# EAGLE design main-stm32-pdipopto-small (EAGLE 9.0.0)
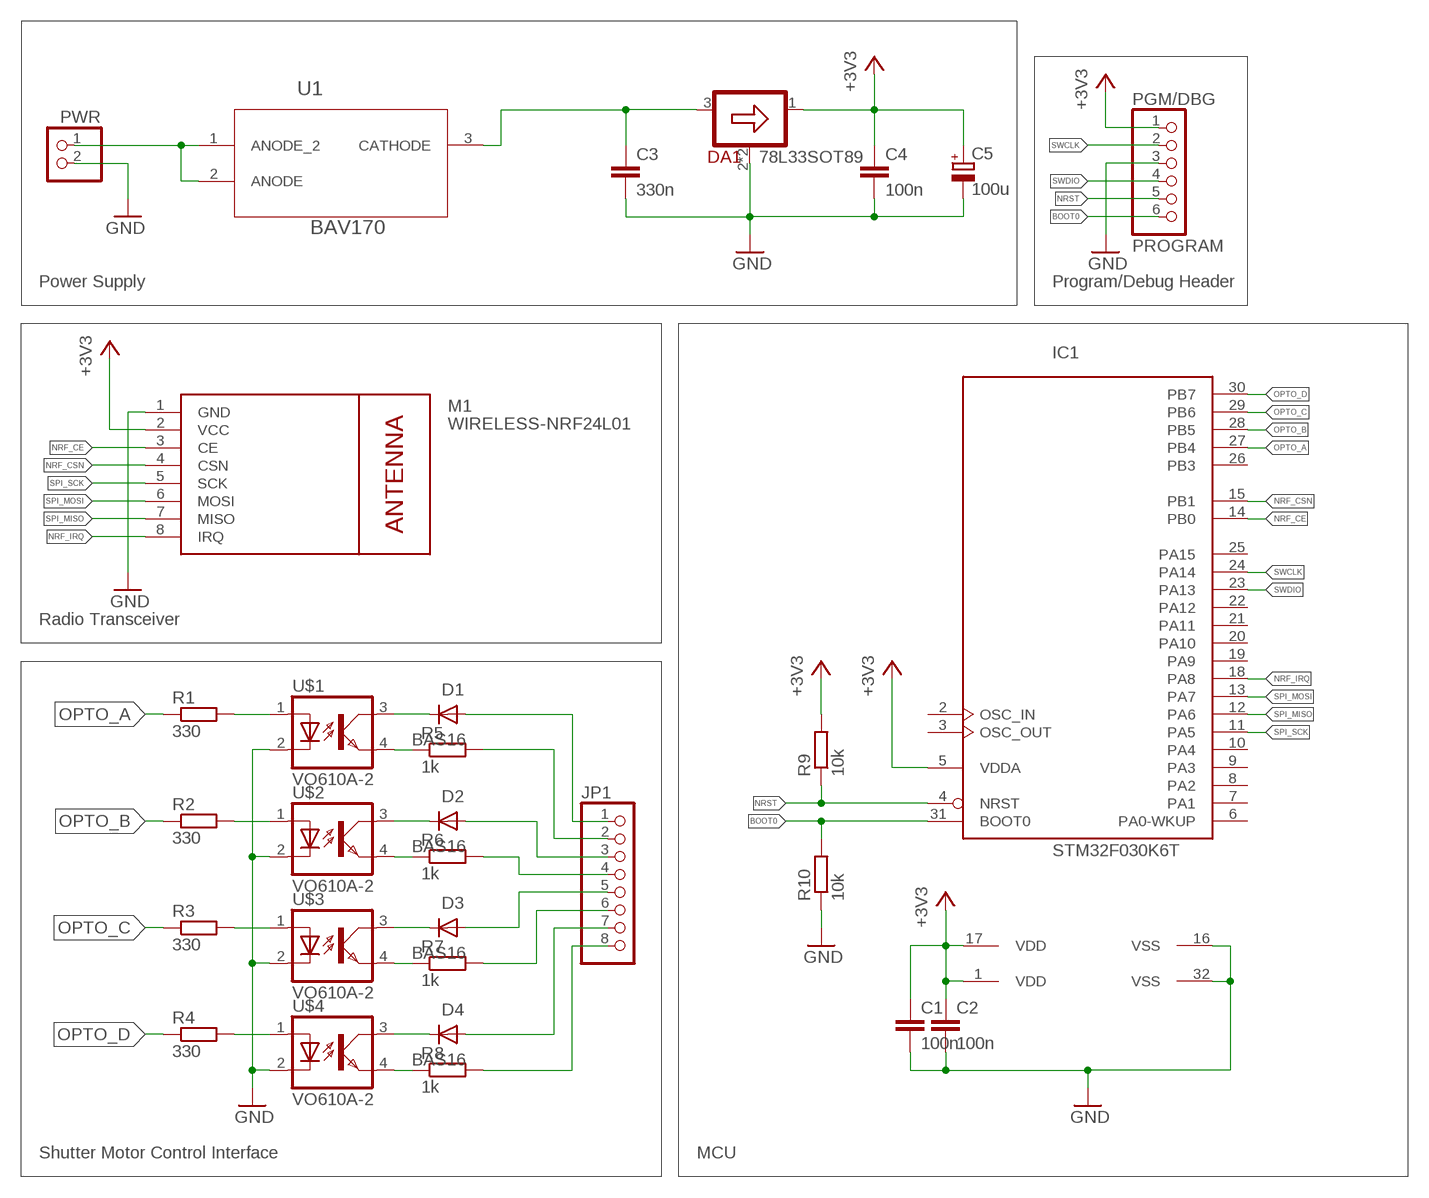
[diagram p0: schematic, sheet 1]

## Parts
C1  100n  C-EUC0805  [C0805]
C2  100n  C-EUC0805  [C0805]
C3  330n  C-EUC0805  [C0805]
C4  100n  C-EUC0805  [C0805]
C5  100u  CPOL-EUUD-5X5,8  [UD-5X5,8_NICHICON]
D1  BAS16  [SOT23]
D2  BAS16  [SOT23]
D3  BAS16  [SOT23]
D4  BAS16  [SOT23]
DA1  78L33SOT89  [SOT89]
IC1  STM32F030K6T  [LQFP32]
JP1  PINHD-1X8  [1X08]
M1  WIRELESS-NRF24L01  [WIRELESS-NRF24L01]
PGM/DBG  PROGRAM  PINHD-1X6  [1X06]
PWR  PINHD-1X2  [1X02]
R1  330  R-EU_R0805  [R0805]
R2  330  R-EU_R0805  [R0805]
R3  330  R-EU_R0805  [R0805]
R4  330  R-EU_R0805  [R0805]
R5  1k  R-EU_R0805  [R0805]
R6  1k  R-EU_R0805  [R0805]
R7  1k  R-EU_R0805  [R0805]
R8  1k  R-EU_R0805  [R0805]
R9  10k  R-EU_R0805  [R0805]
R10  10k  R-EU_R0805  [R0805]
U1  BAV170  [SOT95P240X110-3N]
U$1  VO610A-2  [DIL04]
U$2  VO610A-2  [DIL04]
U$3  VO610A-2  [DIL04]
U$4  VO610A-2  [DIL04]

## Nets
+3V3: C1.1 C2.1 C4.1 C5.+ DA1.1(OUT) IC1.1(VDD) IC1.5(VDDA) IC1.17(VDD) M1.2(VCC) PGM/DBG.1 R9.2
BOOT0: IC1.31(BOOT0) PGM/DBG.6 R10.2
GND: C1.2 C2.2 C3.2 C4.2 C5.- DA1.2(GND) DA1.2@1(GND) IC1.16(VSS) IC1.32(VSS) M1.1(GND) PGM/DBG.3 PWR.2 R10.1 U$1.2(C) U$2.2(C) U$3.2(C) U$4.2(C)
N$1: R5.1 U$1.4(EMIT)
N$2: JP1.2 R5.2
N$3: R1.2 U$1.1(A)
N$4: R2.2 U$2.1(A)
N$5: D1.3(K) U$1.3(COL)
N$6: D2.3(K) U$2.3(COL)
N$7: D3.3(K) U$3.3(COL)
N$8: D4.3(K) U$4.3(COL)
N$9: D1.1(A) JP1.1
N$10: R6.1 U$2.4(EMIT)
N$11: D2.1(A) JP1.3
N$12: JP1.4 R6.2
N$13: D3.1(A) JP1.5
N$14: R7.1 U$3.4(EMIT)
N$15: D4.1(A) JP1.7
N$16: JP1.6 R7.2
N$17: R3.2 U$3.1(A)
N$18: R4.2 U$4.1(A)
N$19: R8.1 U$4.4(EMIT)
N$20: JP1.8 R8.2
N$21: PWR.1 U1.1(ANODE_2) U1.2(ANODE)
N$22: C3.1 DA1.3(IN) U1.3(CATHODE)
NRF_CE: IC1.14(PB0) M1.3(CE)
NRF_CSN: IC1.15(PB1) M1.4(CSN)
NRF_IRQ: IC1.18(PA8) M1.8(IRQ)
NRST: IC1.4(NRST) PGM/DBG.5 R9.1
OPTO_A: IC1.27(PB4) R1.1
OPTO_B: IC1.28(PB5) R2.1
OPTO_C: IC1.29(PB6) R3.1
OPTO_D: IC1.30(PB7) R4.1
SPI_MISO: IC1.12(PA6) M1.7(MISO)
SPI_MOSI: IC1.13(PA7) M1.6(MOSI)
SPI_SCK: IC1.11(PA5) M1.5(SCK)
SWCLK: IC1.24(PA14) PGM/DBG.2
SWDIO: IC1.23(PA13) PGM/DBG.4
Unconnected: IC1.2(OSC_IN) IC1.3(OSC_OUT) IC1.6(PA0-WKUP) IC1.7(PA1) IC1.8(PA2) IC1.9(PA3) IC1.10(PA4) IC1.19(PA9) IC1.20(PA10) IC1.21(PA11) IC1.22(PA12) IC1.25(PA15) IC1.26(PB3)

## Notes on the sheet
- Power Supply | Program/Debug Header
- Radio Transceiver
- Shutter Motor Control Interface | MCU

## Library data of the parts
C1-C4 = rcl:C-EU: CAPACITOR, European symbol; SPICEPREFIX: C
C5 = rcl:CPOL-EU: POLARIZED CAPACITOR, European symbol; SPICEPREFIX: C
D1-D4 = nxp_60:BAS16: High-speed switching diode High-speed switching diode, encapsulated in small Surface-Mounted Device (SMD) plastic packages. AAL Eindhoven MK
DA1 = regulators-linear:78L33
IC1 = micro-stm_v3:STM32F030K*T: ARM 32-bit Cortex™-M0 CPU 48 MHz maximum frequency 32 Kbytes of Flash memory 4 kbytes of SRAM 26 GPIOs 2.4 to 3.6 V application supply
JP1 = pinhead:PINHD-1X8: PIN HEADER
M1 = diy-modules:WIRELESS-NRF24L01: 2.4 GHz Wireless Module based on NRF24L01 chip More details available here: http://www.electrodragon.com/w/NRF24L01 Click here to find device on ebay.com <http://www.ebay.com/sch/nrf24l01+arduino>
PGM/DBG = pinhead:PINHD-1X6: PIN HEADER
PWR = pinhead:PINHD-1X2: PIN HEADER
R1-R10 = rcl:R-EU_: RESISTOR, European symbol; SPICEPREFIX: R
U1 = diodes-inc-e14:BAV170: DUAL SURFACE MOUNT LOW LEAKAGE DIODE; MPN: BAV170; OC_FARNELL: 1902412; OC_NEWARK: 55T0016; PACKAGE: SOT-23-3; SUPPLIER: DIODES INC.
U$1-U$4 = opto-VO610A:VO610A-2

## Board
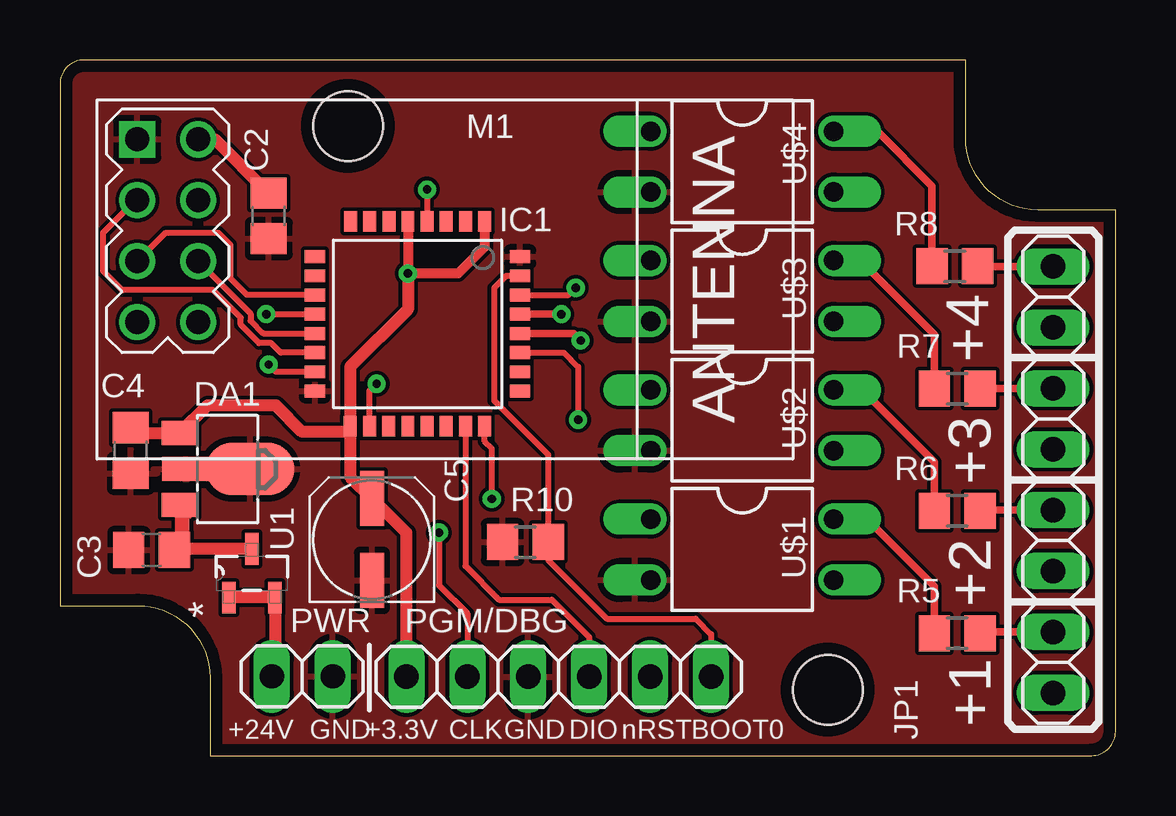
[diagram p1: board, top side]
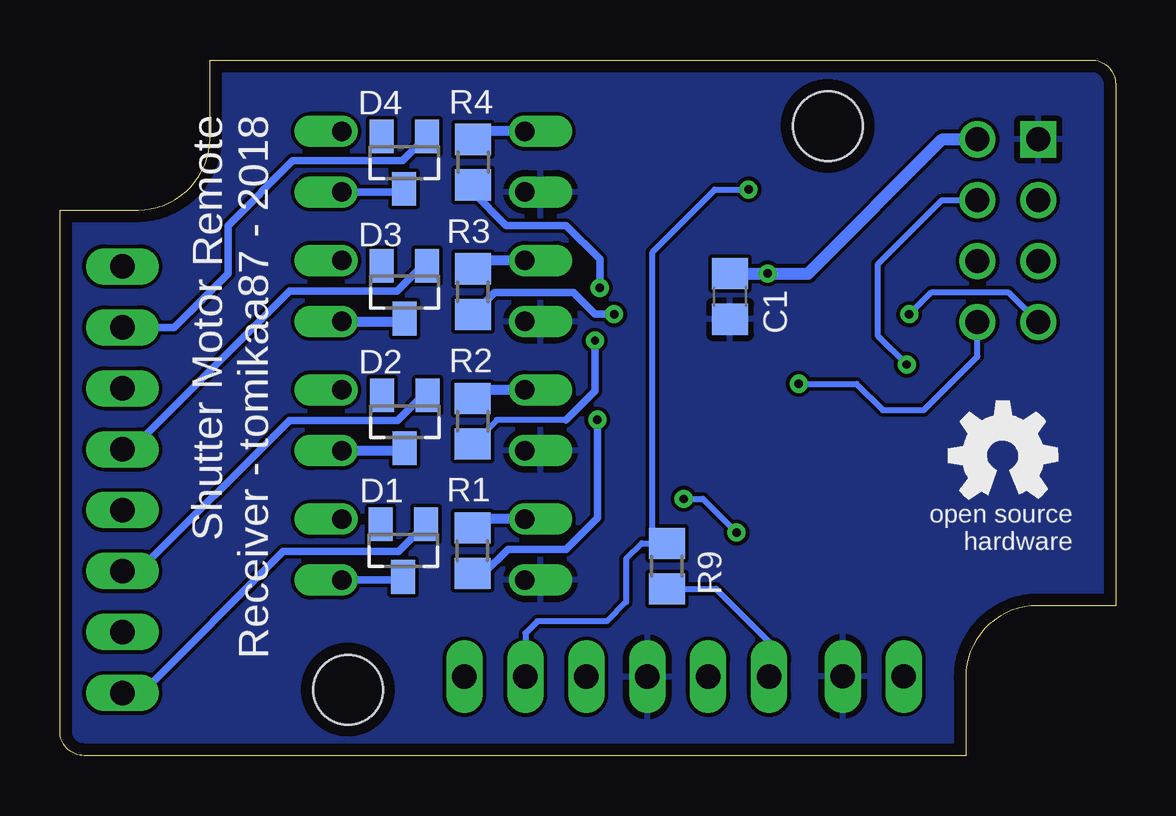
[diagram p2: board, bottom side, seen from below]

Size 44 x 29 mm. Coordinates in mm from the lower left corner, seen from the top.
Outline: 6.25,0 43,0 arc90 44,1 44,22.75 40.75,22.75 arc-90 37.75,25.75 37.75,29 1,29 arc90 0,28 0,6.25 3.25,6.25 arc-90 6.25,3.25 6.25,0
Copper layers (1*16): Top 0.035mm / dielectric 1.5mm / Bottom 0.035mm
Design rules "default *": minimum track width 3.5mil, minimum drill 0.2mm, track to track 6mil, track to pad 6mil, pad to pad 6mil, via to via 6mil, smd to smd 6mil, copper to edge 0.5mm, drill to drill 6mil, minimum pad ring 10mil, minimum via ring 8mil, stop-mask expansion 4mil, vias tented up to drill 0mil, thermal gap 10mil
Holes 2.9 mm at 12,26.25 32,2.75

### Footprints (pad centres in the part's own frame; a part is rotated, then mirrored left to right if it is on the bottom)
C0805 = smd 1.3 x 1.5: 1 -0.95,0; 2 0.95,0
UD-5X5,8_NICHICON = smd 2.3 x 1: + 1.725,0; - -1.7,0
SOT23 = smd 1 x 1.4: 1 -0.95,-1.1; 2 0.95,-1.1; 3 0,1.1
SOT89 = smd 1 x 1.5: 1 -1.499,-1.981; 3 1.499,-1.981 | smd 1 x 2: 2 0,-1.727 | smd 2.2 x 3.7: 2@1 0,0.94
LQFP32 = smd 0.54 x 0.85: 1 -2.8,-4.275; 2 -2,-4.275; 3 -1.2,-4.275; 4 -0.4,-4.275; 5 0.4,-4.275; 6 1.19,-4.275; 7 1.99,-4.275; 8 2.79,-4.275; 17 2.8,4.275; 18 2,4.275; 19 1.2,4.275; 20 0.4,4.275; 21 -0.4,4.275; 22 -1.2,4.275; 23 -2,4.275; 24 -2.8,4.275 | smd 0.85 x 0.54: 9 4.275,-2.8; 10 4.275,-2; 11 4.275,-1.2; 12 4.275,-0.4; 13 4.275,0.4; 14 4.275,1.2; 15 4.275,2; 16 4.275,2.8; 25 -4.275,2.8; 26 -4.275,2; 27 -4.275,1.2; 28 -4.275,0.4; 29 -4.275,-0.4; 30 -4.275,-1.2; 31 -4.275,-2; 32 -4.275,-2.8
1X08 = drill 1.016 long: 1 -8.89,0; 2 -6.35,0; 3 -3.81,0; 4 -1.27,0; 5 1.27,0; 6 3.81,0; 7 6.35,0; 8 8.89,0
WIRELESS-NRF24L01 = drill 1 square: 1 -12.7,6.35 | drill 1: 2 -10.16,6.35; 3 -12.7,3.81; 4 -10.16,3.81; 5 -12.7,1.27; 6 -10.16,1.27; 7 -12.7,-1.27; 8 -10.16,-1.27
1X06 = drill 1.016 long: 1 -6.35,0; 2 -3.81,0; 3 -1.27,0; 4 1.27,0; 5 3.81,0; 6 6.35,0
1X02 = drill 1.016 long: 1 -1.27,0; 2 1.27,0
R0805 = smd 1.3 x 1.5: 1 -0.95,0; 2 0.95,0
SOT95P240X110-3N = smd 1.321 x 0.559: 1 -1.016,0.965; 2 -1.016,-0.965; 3 1.016,0
DIL04 = drill 0.813 offset: 1 -1.27,-3.81; 2 1.27,-3.81; 3 1.27,3.81; 4 -1.27,3.81

### Placement (x,y rotation side)
C1  16.07,19.14 270 bottom
C2  8.7,22.5 270 top
C3  3.82,8.57 180 top
C4  2.95,12.72 270 top
C5  13,9 90 top
D1  29.69,8.55 180 bottom
D2  29.63,13.92 180 bottom
D3  29.64,19.32 180 bottom
D4  29.65,24.72 180 bottom
DA1  6.98,11.94 270 top
IC1  14.9,18 180 top
JP1  41.4,11.5 90 top
M1  15.92,19.34 0 top
PGM/DBG  20.79,3.29 0 top
PWR  10.1,3.3 0 top
R1  26.81,8.54 90 bottom
R2  26.8,13.94 90 bottom
R3  26.79,19.34 90 bottom
R4  26.78,24.74 90 bottom
R5  37.4,5.1 0 top
R6  37.4,10.2 0 top
R7  37.4,15.3 0 top
R8  37.3,20.4 0 top
R9  18.7,7.9 270 bottom
R10  19.4,8.9 0 top
U1  8,7.6 90 top
U$1  28.44,8.59 270 top
U$2  28.44,13.98 270 top
U$3  28.44,19.37 270 top
U$4  28.44,24.76 270 top
U$5  [OSHW_5MM]  4.7,12.5 0 bottom

### Tracks (layer width: path | path; a pad name or v marks a point on that pad's centre or on a via)
+3V3  (via drill 0.35)
  Top 0.406: IC1.5 v14.5,20.1 16.6,20.1 17.7,21.2 IC1.1
  Top 0.508: v14.5,20.1 14.5,18.6 12.1,16.2 IC1.17 | C4.1 3.18,13.44 DA1.1 6.16,14.6 9,14.6 10.1,13.5 11.88,13.5 IC1.17 | C2.1 6.46,25.69 M1.2 | PGM/DBG.1 14.44,9.29 C5.+ 12.1,11.62 IC1.17
  Bottom 0.254: R9.2 16.65,6.95 14.44,4.74 PGM/DBG.1
  Bottom 0.508: C1.1 v14.51,20.09 | v14.51,20.09 v14.5,20.1 | v14.51,20.09 12.81,20.09 7.21,25.69 M1.2
BOOT0
  Top 0.254: IC1.31 18.6,20 18.1,19.5 18.1,14.8 20.35,12.55 R10.2 20.35,8.15 22.8,5.7 26.5,5.7 27.14,5.06 PGM/DBG.6
GND
  pour Bottom: 0,6.25 0,28 arc-90 1,29 37.75,29 37.75,25.75 arc90 40.75,22.75 44,22.75 44,1 arc-90 43,0 6.25,0 6.25,3.25 arc90 3.25,6.25
  pour Top: 0,6.25 0,28 arc-90 1,29 37.75,29 37.75,25.75 arc90 40.75,22.75 44,22.75 44,1 arc-90 43,0 6.25,0 6.25,3.25 arc90 3.25,6.25
N$1
  Top 0.305: R5.1 36.45,7.05 33.64,9.86 U$1.4
N$2
  Top 0.305: JP1.2 38.4,5.15 R5.2
N$3
  Bottom 0.406: U$1.1 26.71,9.86 R1.2
N$4
  Bottom 0.406: U$2.1 26.69,15.25 R2.2
N$5
  Bottom 0.305: 29.82,7.32 U$1.3
  Bottom 0.406: D1.3 29.82,7.32
N$6
  Bottom 0.406: U$2.3 29.74,12.71 D2.3
N$7
  Bottom 0.406: U$3.3 29.76,18.1 D3.3
N$8
  Bottom 0.305: 29.78,23.49 U$4.3
  Bottom 0.406: 29.78,23.49 D4.3
N$9
  Bottom 0.305: D1.1 29.88,8.51 34.69,8.51 40.6,2.6 JP1.1
N$10
  Top 0.305: 32.75,15.25 U$2.4 33.45,15.25 36.45,12.25 R6.1
N$11
  Bottom 0.305: 28.88,15.02 29.93,13.96 34.44,13.96 40.71,7.69 JP1.3
  Bottom 0.406: D2.1 28.88,15.02
N$12
  Top 0.305: JP1.4 38.38,10.23 R6.2
N$13
  Bottom 0.305: 28.89,20.42 29.94,19.36 34.44,19.36 41.03,12.77 JP1.5
  Bottom 0.406: D3.1 28.89,20.42
N$14
  Top 0.305: R7.1 36.45,17.55 33.36,20.64 U$3.4
N$15
  Bottom 0.305: D4.1 29.72,24.8 34.3,24.8 37,22.1 37,20.1 39.25,17.85 JP1.7
N$16
  Top 0.305: JP1.6 R7.2
N$17
  Bottom 0.406: U$3.1 26.67,20.64 R3.2
N$18
  Bottom 0.406: U$4.1 26.65,26.03 R4.2
N$19
  Top 0.305: R8.1 36.35,23.75 34.07,26.03 U$4.4
N$20
  Top 0.305: JP1.8 R8.2
N$21
  Top 0.508: PWR.1 8.96,3.44 U1.2 U1.1
N$22
  Top 0.508: 5.33,10.11 DA1.3 | U1.3 4.82,8.62 C3.1
  Top 0.61: C3.1 5.1,8.57 5.1,10.34 DA1.3
NRF_CE
  Top 0.254: IC1.14 9.2,16.8 8.81,17.19 8.3,17.19 7.54,17.96 7.54,18.26 6.39,19.4 2.6,19.4 1.8,20.2 1.8,21.8 3.15,23.15 M1.3
NRF_CSN  (via drill 0.35)
  Top 0.254: IC1.15 9,16 v8.7,16.3
  Bottom 0.254: v8.7,16.3 9.9,17.5 9.9,20.5 7.25,23.15 M1.4
NRF_IRQ  (via drill 0.35)
  Top 0.254: IC1.18 12.9,15.2 v13.2,15.5
  Bottom 0.254: v13.2,15.5 10.8,15.5 9.7,14.4 8,14.4 5.76,16.64 M1.8
NRST  (via drill 0.35)
  Top 0.254: v15.3,23.6 IC1.4
  Bottom 0.254: 19.3,8.85 19.75,8.85 20.4,8.2 20.4,6.4 21.2,5.6 22.9,5.6 24.1,5.6 24.6,5.1 PGM/DBG.5 | 19.3,8.85 R9.1 | 19.3,8.85 19.3,21 16.7,23.6 v15.3,23.6
OPTO_A  (via drill 0.35)
  Top 0.254: IC1.27 21,16.8 21.6,16.2 v21.6,14
  Bottom 0.254: 26.34,7.59 R1.1
  Bottom 0.305: v21.6,14 21.6,9.9 22.9,8.6 25.33,8.6 26.34,7.59
OPTO_B  (via drill 0.35)
  Top 0.305: IC1.28 21.4,17.6 v21.7,17.3
  Bottom 0.254: R2.1 25.79,14 22.9,14
  Bottom 0.305: v21.7,17.3 21.7,15.2 22.9,14
OPTO_C  (via drill 0.35)
  Top 0.305: v20.9,18.4 IC1.29
  Bottom 0.305: R3.1 25.88,19.3 22.6,19.3 21.7,18.4 v20.9,18.4
OPTO_D  (via drill 0.35)
  Top 0.254: IC1.30 21.2,19.2 v21.5,19.5
  Bottom 0.254: 26.78,23.48 R4.1
  Bottom 0.305: v21.5,19.5 21.5,20.7 22.9,22.1 25.4,22.1 26.78,23.48
SPI_MISO  (via drill 0.35)
  Top 0.254: v8.6,18.4 IC1.12
  Bottom 0.254: M1.7 4.45,19.3 7.7,19.3 v8.6,18.4
SPI_MOSI
  Top 0.254: M1.6 7.94,18.43 7.94,18.13 8.47,17.6 IC1.13
SPI_SCK
  Top 0.254: 10.2,19.2 IC1.11 7.8,19.2 7.1,19.9 7.1,21.3 6.6,21.8 4.41,21.8 M1.5
SWCLK  (via drill 0.35)
  Top 0.254: v15.8,9.3 15.8,7.1 16.98,5.92 PGM/DBG.2 | v18,10.7 18,12.8 17.7,13.1 IC1.24
  Bottom 0.254: v18,10.7 17.2,10.7 v15.8,9.3
SWDIO
  Top 0.254: IC1.23 16.9,7.9 18.3,6.5 20.5,6.5 22.06,4.94 PGM/DBG.4

### Text on the board
tNames: +4 | +3 | +2 | +24V | GND | +3.3V | CLK | GND | DIO | nRST | BOOT0 | +1
bNames: Shutter Motor Remote / Receiver - tomikaa87 - 2018